# Altium schematic sheet A3979alone.SchDoc
size A4
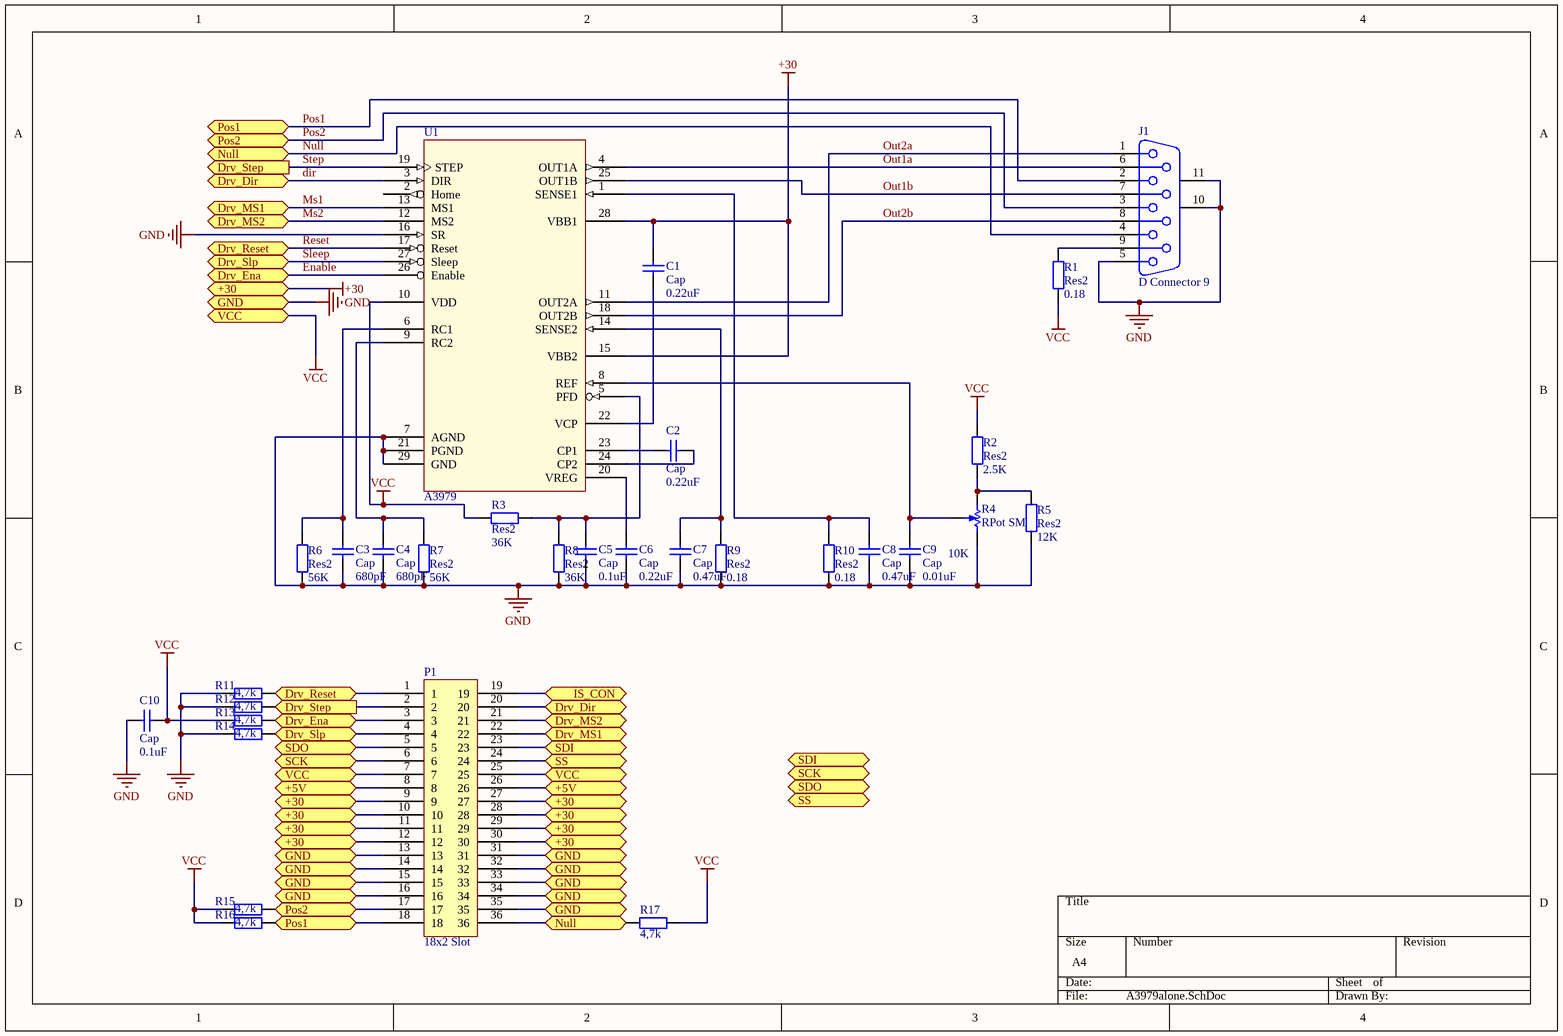
[diagram p0: A3979alone.SchDoc]

## Parts
C1  Cap  value 0.22uF  [CAPC3225L]
C2  Cap  value 0.22uF  [CapC3225L]
C3  Cap  value 680pF  [CAPC2012L]
C4  Cap  value 680pF  [CAPC2012L]
C5  Cap  value 0.1uF  [CAPC3225L]
C6  Cap  value 0.22uF  [CAPC3225L]
C7  Cap  value 0.47uF  [CAPC3225L]
C8  Cap  value 0.47uF  [CAPC3225L]
C9  Cap  value 0.01uF  [CAPC2012L]
C10  Cap  value 0.1uF  [CAPC3225L]
J1  D Connector 9  [D-SUB-9]
P1  18x2 Slot  [SL-36]
R1  Res2  value 0.18  [RESC2012M]
R2  Res2  value 2.5K  [RESC2012M]
R3  Res2  value 36K  [RESC2012M]
R4  RPot SM  value 10K  [VarRes1]
R5  Res2  value 12K  [RESC2012M]
R6  Res2  value 56K  [RESC2012M]
R7  Res2  value 56K  [RESC2012M]
R8  Res2  value 36K  [RESC2012M]
R9  Res2  value 0.18  [RESC6332L]
R10  Res2  value 0.18  [RESC6332L]
R11  value 4,7k  [RESC2012M]  (hidden comment: Res2)
R12  value 4,7k  [RESC2012M]  (hidden comment: Res2)
R13  value 4,7k  [RESC2012M]  (hidden comment: Res2)
R14  value 4,7k  [RESC2012M]  (hidden comment: Res2)
R15  value 4,7k  [RESC2012M]  (hidden comment: Res2)
R16  value 4,7k  [RESC2012M]  (hidden comment: Res2)
R17  value 4,7k  [RESC2012M]  (hidden comment: Res2)
U1  A3979  [TSOP65P640_HS-28AM]

## Ports
+5V, +30, Drv_Dir, Drv_Ena, Drv_MS1, Drv_MS2, Drv_Reset, Drv_Slp, Drv_Step (out), GND, IS_CON, Null, Pos1, Pos2, SCK, SDI, SDO, SS, VCC

## Nets
+30: C1.2 P1.9 P1.10 P1.11 P1.12 P1.27 P1.28 P1.29 P1.30 U1.15(VBB2) U1.28(VBB1) ; port +30
GND: C3.1 C4.1 C5.1 C6.1 C7.1 C8.1 C9.1 C10.1 J1.5 J1.10(MH1) J1.11(MH2) P1.13 P1.14 P1.15 P1.16 P1.31 P1.32 P1.33 P1.34 P1.35 R4.CW(+) R5.1 R6.1 R7.1 R8.1 R9.1 R10.1 R11.1 R12.1 R14.1 U1.7(AGND) U1.16(SR) U1.21(PGND) U1.29(GND) ; port GND
VCC: C10.2 P1.7 P1.25 R1.1 R2.2 R3.2 R13.1 R15.1 R16.1 R17.2 U1.10(VDD) ; port VCC
+5V: P1.8 P1.26 ; port +5V
dir: P1.20 U1.3(DIR) ; port Drv_Dir
Enable: P1.3 R13.2 U1.26(Enable) ; port Drv_Ena
IS_CON: P1.19 ; port IS_CON
Ms1: P1.22 U1.13(MS1) ; port Drv_MS1
Ms2: P1.21 U1.12(MS2) ; port Drv_MS2
Null: J1.4 P1.36 R17.1 ; port Null
Out1a: J1.6 U1.4(OUT1A)
Out1b: J1.7 U1.25(OUT1B)
Out2a: J1.1 U1.11(OUT2A)
Out2b: J1.8 U1.18(OUT2B)
Pos1: J1.2 P1.18 R16.2 ; port Pos1
Pos2: J1.3 P1.17 R15.2 ; port Pos2
Reset: P1.1 R11.2 U1.17(Reset) ; port Drv_Reset
SCK: P1.6 ; port SCK
SDI: P1.23 ; port SDI
SDO: P1.5 ; port SDO
Sleep: P1.4 R14.2 U1.27(Sleep) ; port Drv_Slp
SS: P1.24 ; port SS
Step: P1.2 R12.2 U1.19(STEP) ; port Drv_Step
NetC1_1: C1.1 U1.22(VCP)
NetC2_1: C2.1 U1.24(CP2)
NetC2_2: C2.2 U1.23(CP1)
NetC3_2: C3.2 R6.2 U1.6(RC1)
NetC4_2: C4.2 R7.2 U1.9(RC2)
NetC5_2: C5.2 R3.1 R8.2 U1.5(PFD)
NetC6_2: C6.2 U1.20(VREG)
NetC7_2: C7.2 R9.2 U1.14(SENSE2)
NetC8_2: C8.2 R10.2 U1.1(SENSE1)
NetC9_2: C9.2 R4.W U1.8(REF)
NetJ1_9: J1.9 R1.2
NetR2_1: R2.1 R4.CCW(-) R5.2

Not connected (* = marked no-connect by the designer): U1 2(Home)

## Library data of the parts
C1-C10 = Cap: Capacitor; Published: 8-Jun-2000; LatestRevisionDate: 17-Jul-2002; LatestRevisionNote: Re-released for DXP Platform.; PackageReference: RAD-0.3; Publisher: Altium Limited
J1 = D Connector 9: Receptacle Assembly, 9 Position, Right Angle; PackageDocument: O; Positions: 9; Published: 15-Jun-2001; LatestRevisionDate: 17-Jul-2002; LatestRevisionNote: Re-released for DXP Platform.; DatasheetDocument: 1-Sep-1999; PackageReference: 788750; Publisher: Altium Limited; Orientation: Right Angle; Gender: Receptacle
R1-R3 R5-R17 = Res2: Resistor; Published: 8-Jun-2000; LatestRevisionDate: 17-Jul-2002; LatestRevisionNote: Re-released for DXP Platform.; PackageReference: AXIAL-0.4; Publisher: Altium Limited
R4 = RPot SM: Square Trimming Potentiometer; Published: 17-Dec-2003; DatasheetVersion: Oct-2003; PackageReference: POT4MM-2; Publisher: Altium Limited; ComponentLink1Description: Manufacturer Link; ComponentLink1URL: http://bourns.com/2/search.html
U1 = A3979: Microstepping DMOS Driver with Translator 2.5A